# EasyEDA Pro project EEG.eprj

# Schematic Schematic3
Create Date: 2023-07-28; Page Name: MULTI_PROCESS; Project Name: EEG; Schematic Name: Schematic3; Update Date: 2023-07-29; Company: EasyEDA.com; Drawed: EasyEDA Pro; Page Size: A4; Part Number: JLCPCB-002; Reviewed: EasyEDA Pro; Version: V0.1
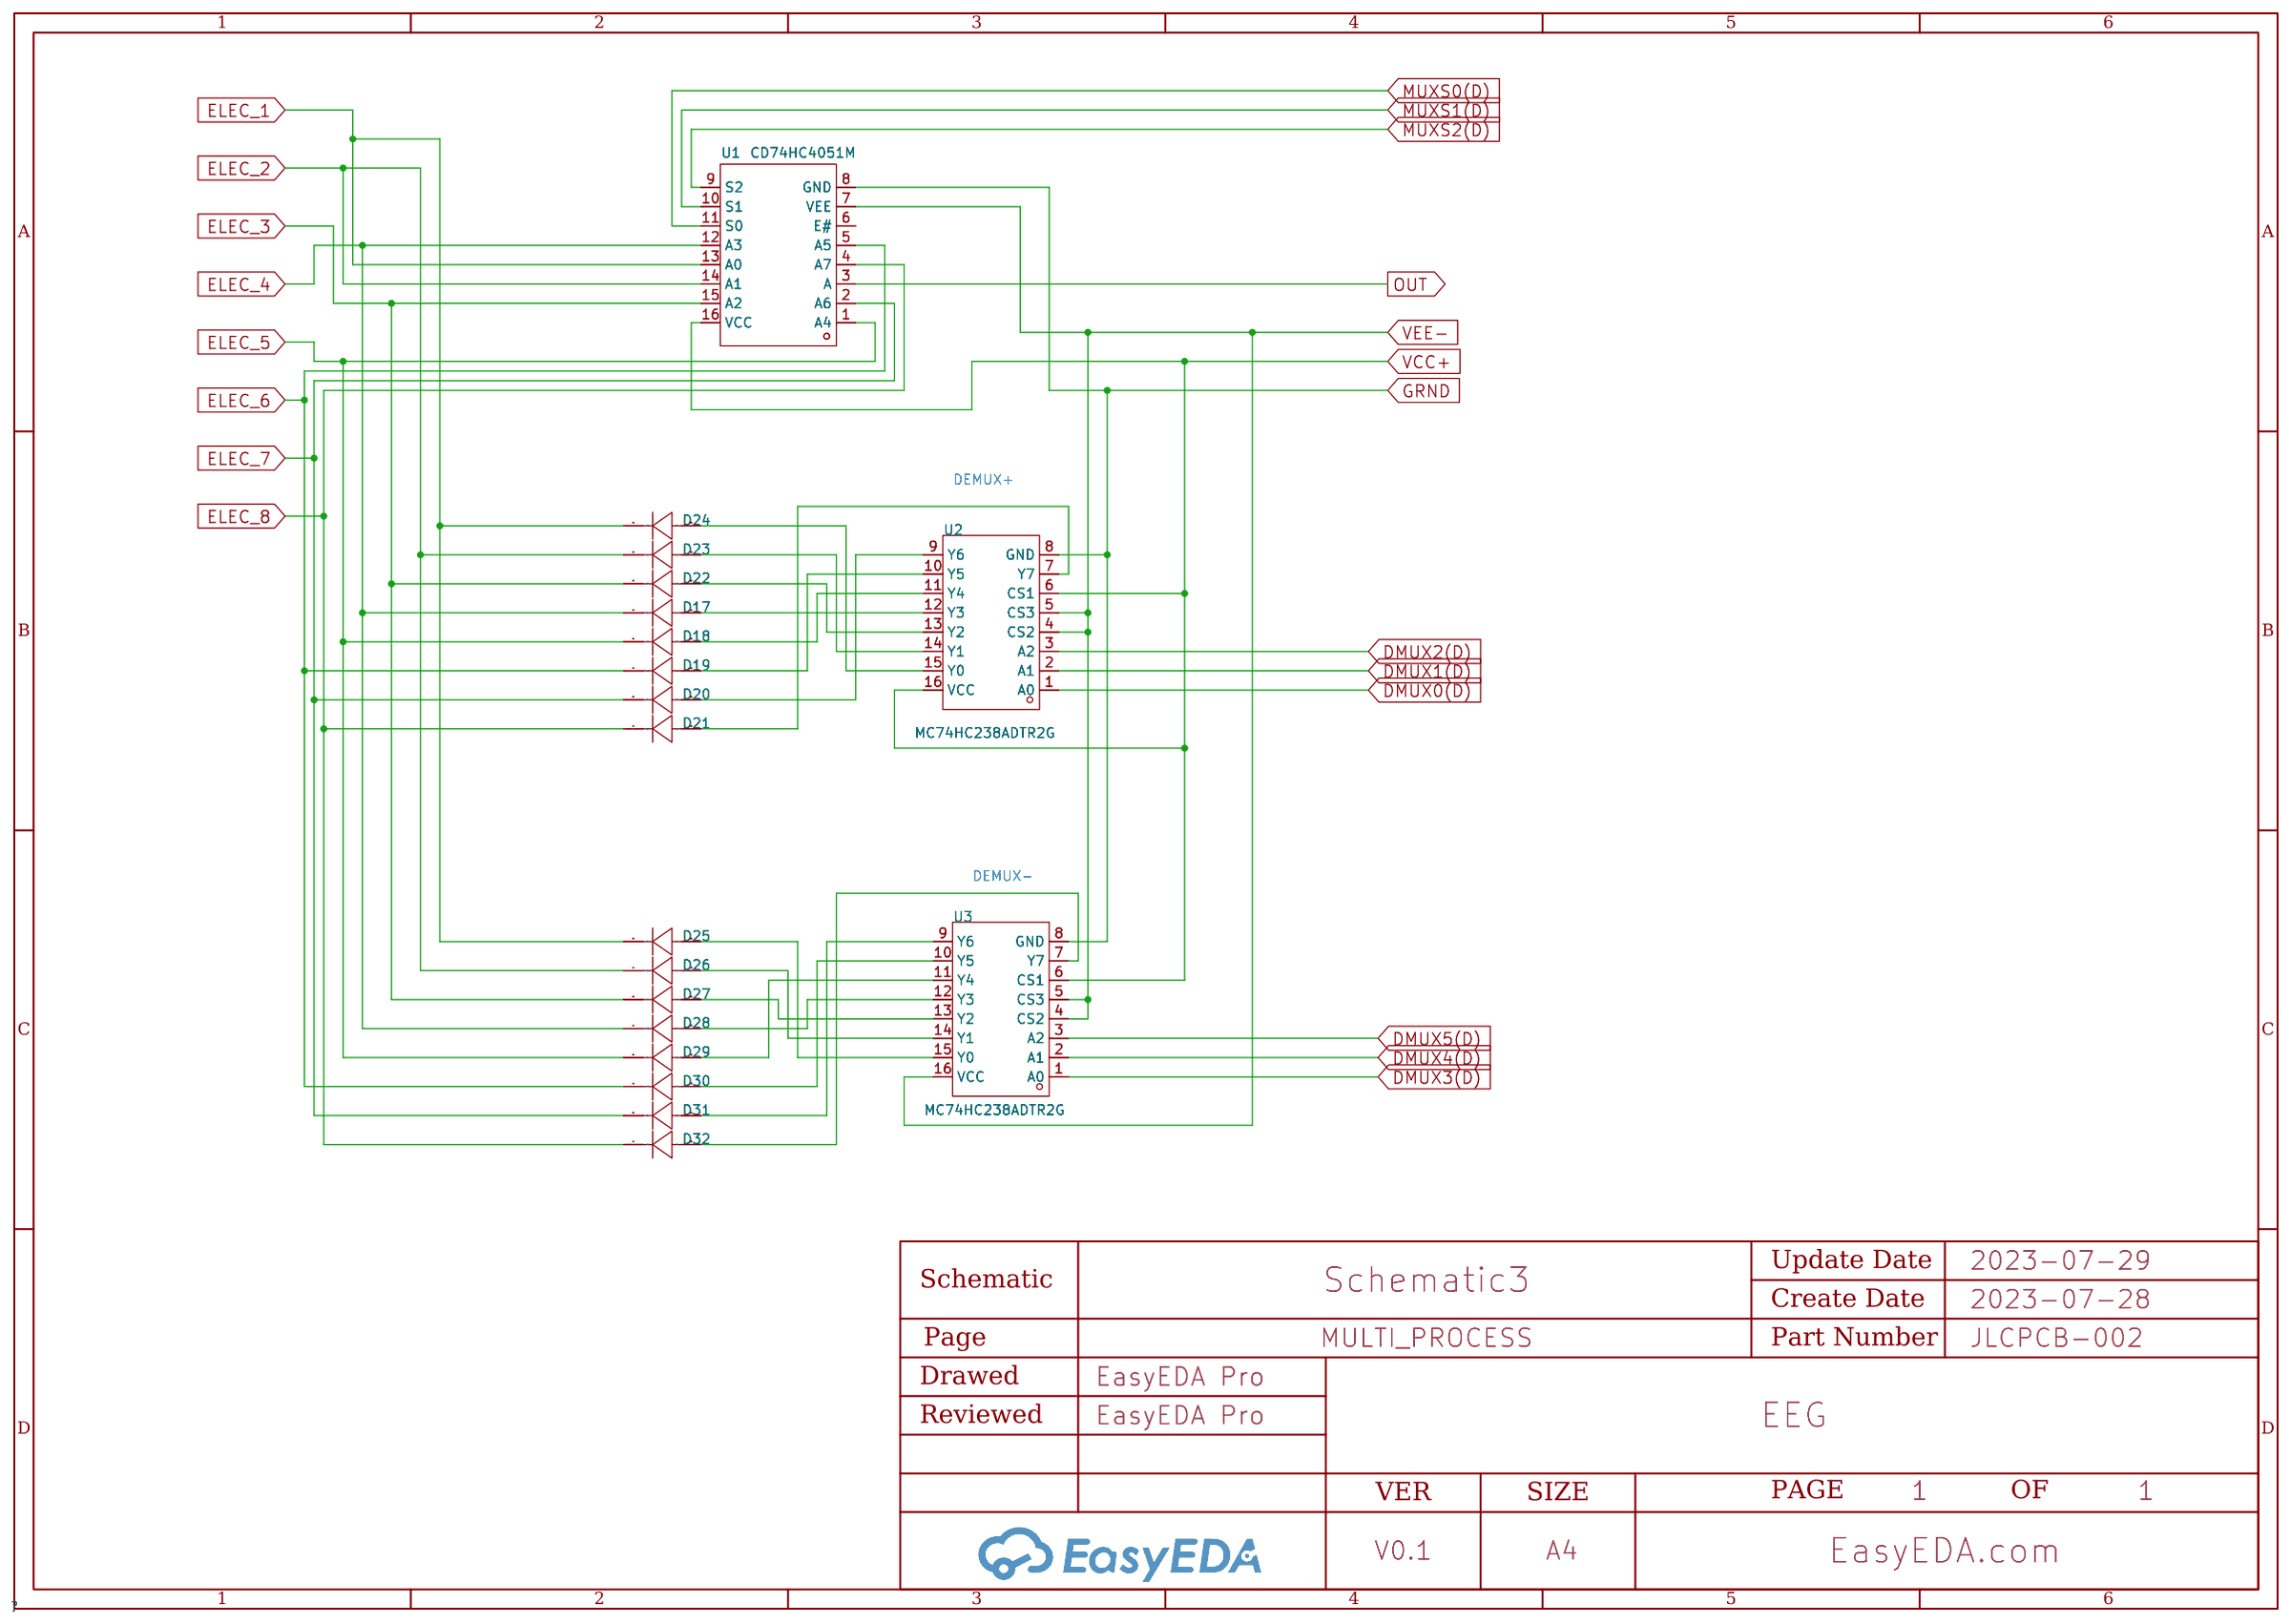
[diagram p0: schematic sheet]

## Parts
D17  -  [DO-41_BD2.4-L4.7-P8.70-D0.9-RD]
D18  -  [DO-41_BD2.4-L4.7-P8.70-D0.9-RD]
D19  -  [DO-41_BD2.4-L4.7-P8.70-D0.9-RD]
D20  -  [DO-41_BD2.4-L4.7-P8.70-D0.9-RD]
D21  -  [DO-41_BD2.4-L4.7-P8.70-D0.9-RD]
D22  -  [DO-41_BD2.4-L4.7-P8.70-D0.9-RD]
D23  -  [DO-41_BD2.4-L4.7-P8.70-D0.9-RD]
D24  -  [DO-41_BD2.4-L4.7-P8.70-D0.9-RD]
D25  -  [DO-41_BD2.4-L4.7-P8.70-D0.9-RD]
D26  -  [DO-41_BD2.4-L4.7-P8.70-D0.9-RD]
D27  -  [DO-41_BD2.4-L4.7-P8.70-D0.9-RD]
D28  -  [DO-41_BD2.4-L4.7-P8.70-D0.9-RD]
D29  -  [DO-41_BD2.4-L4.7-P8.70-D0.9-RD]
D30  -  [DO-41_BD2.4-L4.7-P8.70-D0.9-RD]
D31  -  [DO-41_BD2.4-L4.7-P8.70-D0.9-RD]
D32  -  [DO-41_BD2.4-L4.7-P8.70-D0.9-RD]
U1  CD74HC4051M  [SOIC-16_L9.9-W3.9-P1.27-LS6.0-BL]
U2  MC74HC238ADTR2G  [TSSOP-16_L5.0-W4.3-P0.65-LS6.4-BL]
U3  MC74HC238ADTR2G  [TSSOP-16_L5.0-W4.3-P0.65-LS6.4-BL]

## Library data of the parts
D17-D32 = 1N4007: Supplier Footprint: DO-41
U1 = CD74HC4051M: Switch Circuit:-; Supplier Part: C139301; Manufacturer: TI(德州仪器); Supplier Footprint: SOIC-16; JLCPCB Part Class: Extended Part; Datasheet: https://atta.szlcsc.com/upload/public/pdf/source/20171107/C139301_15100518520421097216.pdf; Supplier: LCSC
U2 U3 = MC74HC238ADTR2G: Type:Decoder/Demultiplexers Sink Current:5.2mA Source Current:5.2mA Voltage Supply Source:Single supply Supply Voltage:2V~6V Supply Voltage:2V~6V Operating temperature:-55℃~+125℃ Operating temperature:-55℃~+125℃; LCSC Part Name: 解码器/多路分解器 2V~6V; Supplier Part: C904037; Manufacturer: onsemi(安森美); Supplier Footprint: TSSOP-16-4.3mm; JLCPCB Part Class: Extended Part; Datasheet: https://atta.szlcsc.com/upload/public/pdf/source/20210719/C904037_FA4C95E1BBB3BF0ECDAA59D4FD74D25B.pdf; Supplier: LCSC; Type: Decoder/Demultiplexers; Sink Current: 5.2mA; Source Current: 5.2mA; Voltage Supply Source: Single supply; Supply Voltage: 2V~6V; Operating temperature: -55℃~+125℃

## Nets
VCC+: U1.16(VCC) U2.6(CS1) U2.16(VCC) U3.6(CS1)
VEE-: U1.7(VEE) U2.4(CS2) U2.5(CS3) U3.4(CS2) U3.5(CS3) U3.16(VCC)
DMUX0(D): U2.1(A0)
DMUX1(D): U2.2(A1)
DMUX2(D): U2.3(A2)
DMUX3(D): U3.1(A0)
DMUX4(D): U3.2(A1)
DMUX5(D): U3.3(A2)
ELEC_1: D24.1(K) D25.1(K) U1.13(A0)
ELEC_2: D23.1(K) D26.1(K) U1.14(A1)
ELEC_3: D22.1(K) D27.1(K) U1.15(A2)
ELEC_4: D17.1(K) D28.1(K) U1.12(A3)
ELEC_5: D18.1(K) D29.1(K) U1.1(A4)
ELEC_6: D19.1(K) D30.1(K) U1.5(A5)
ELEC_7: D20.1(K) D31.1(K) U1.2(A6)
ELEC_8: D21.1(K) D32.1(K) U1.4(A7)
GRND: U1.8(GND) U2.8(GND) U3.8(GND)
MUXS0(D): U1.11(S0)
MUXS1(D): U1.10(S1)
MUXS2(D): U1.9(S2)
OUT: U1.3(A)
$1N1255: D24.2(A) U2.15(Y0)
$1N1260: D23.2(A) U2.14(Y1)
$1N1265: D22.2(A) U2.13(Y2)
$1N1270: D17.2(A) U2.12(Y3)
$1N1273: D18.2(A) U2.11(Y4)
$1N1278: D19.2(A) U2.10(Y5)
$1N1283: D20.2(A) U2.9(Y6)
$1N1288: D21.2(A) U2.7(Y7)
$1N1295: D25.2(A) U3.15(Y0)
$1N1300: D26.2(A) U3.14(Y1)
$1N1305: D27.2(A) U3.13(Y2)
$1N1318: D29.2(A) U3.11(Y4)
$1N1345: D28.2(A) U3.12(Y3)
$1N1348: D30.2(A) U3.10(Y5)
$1N1353: D31.2(A) U3.9(Y6)
$1N1358: D32.2(A) U3.7(Y7)

Not connected (* = marked no-connect by the designer): U1 6(E#)

## Notes on the sheet
- DEMUX+
- DEMUX-

# Schematic Schematic4
Create Date: 2023-07-28; Page Name: P1; Project Name: EEG; Schematic Name: Schematic4; Update Date: 2023-07-29; Company: EasyEDA.com; Drawed: EasyEDA Pro; Page Size: A4; Part Number: JLCPCB-002; Reviewed: EasyEDA Pro; Version: V0.1
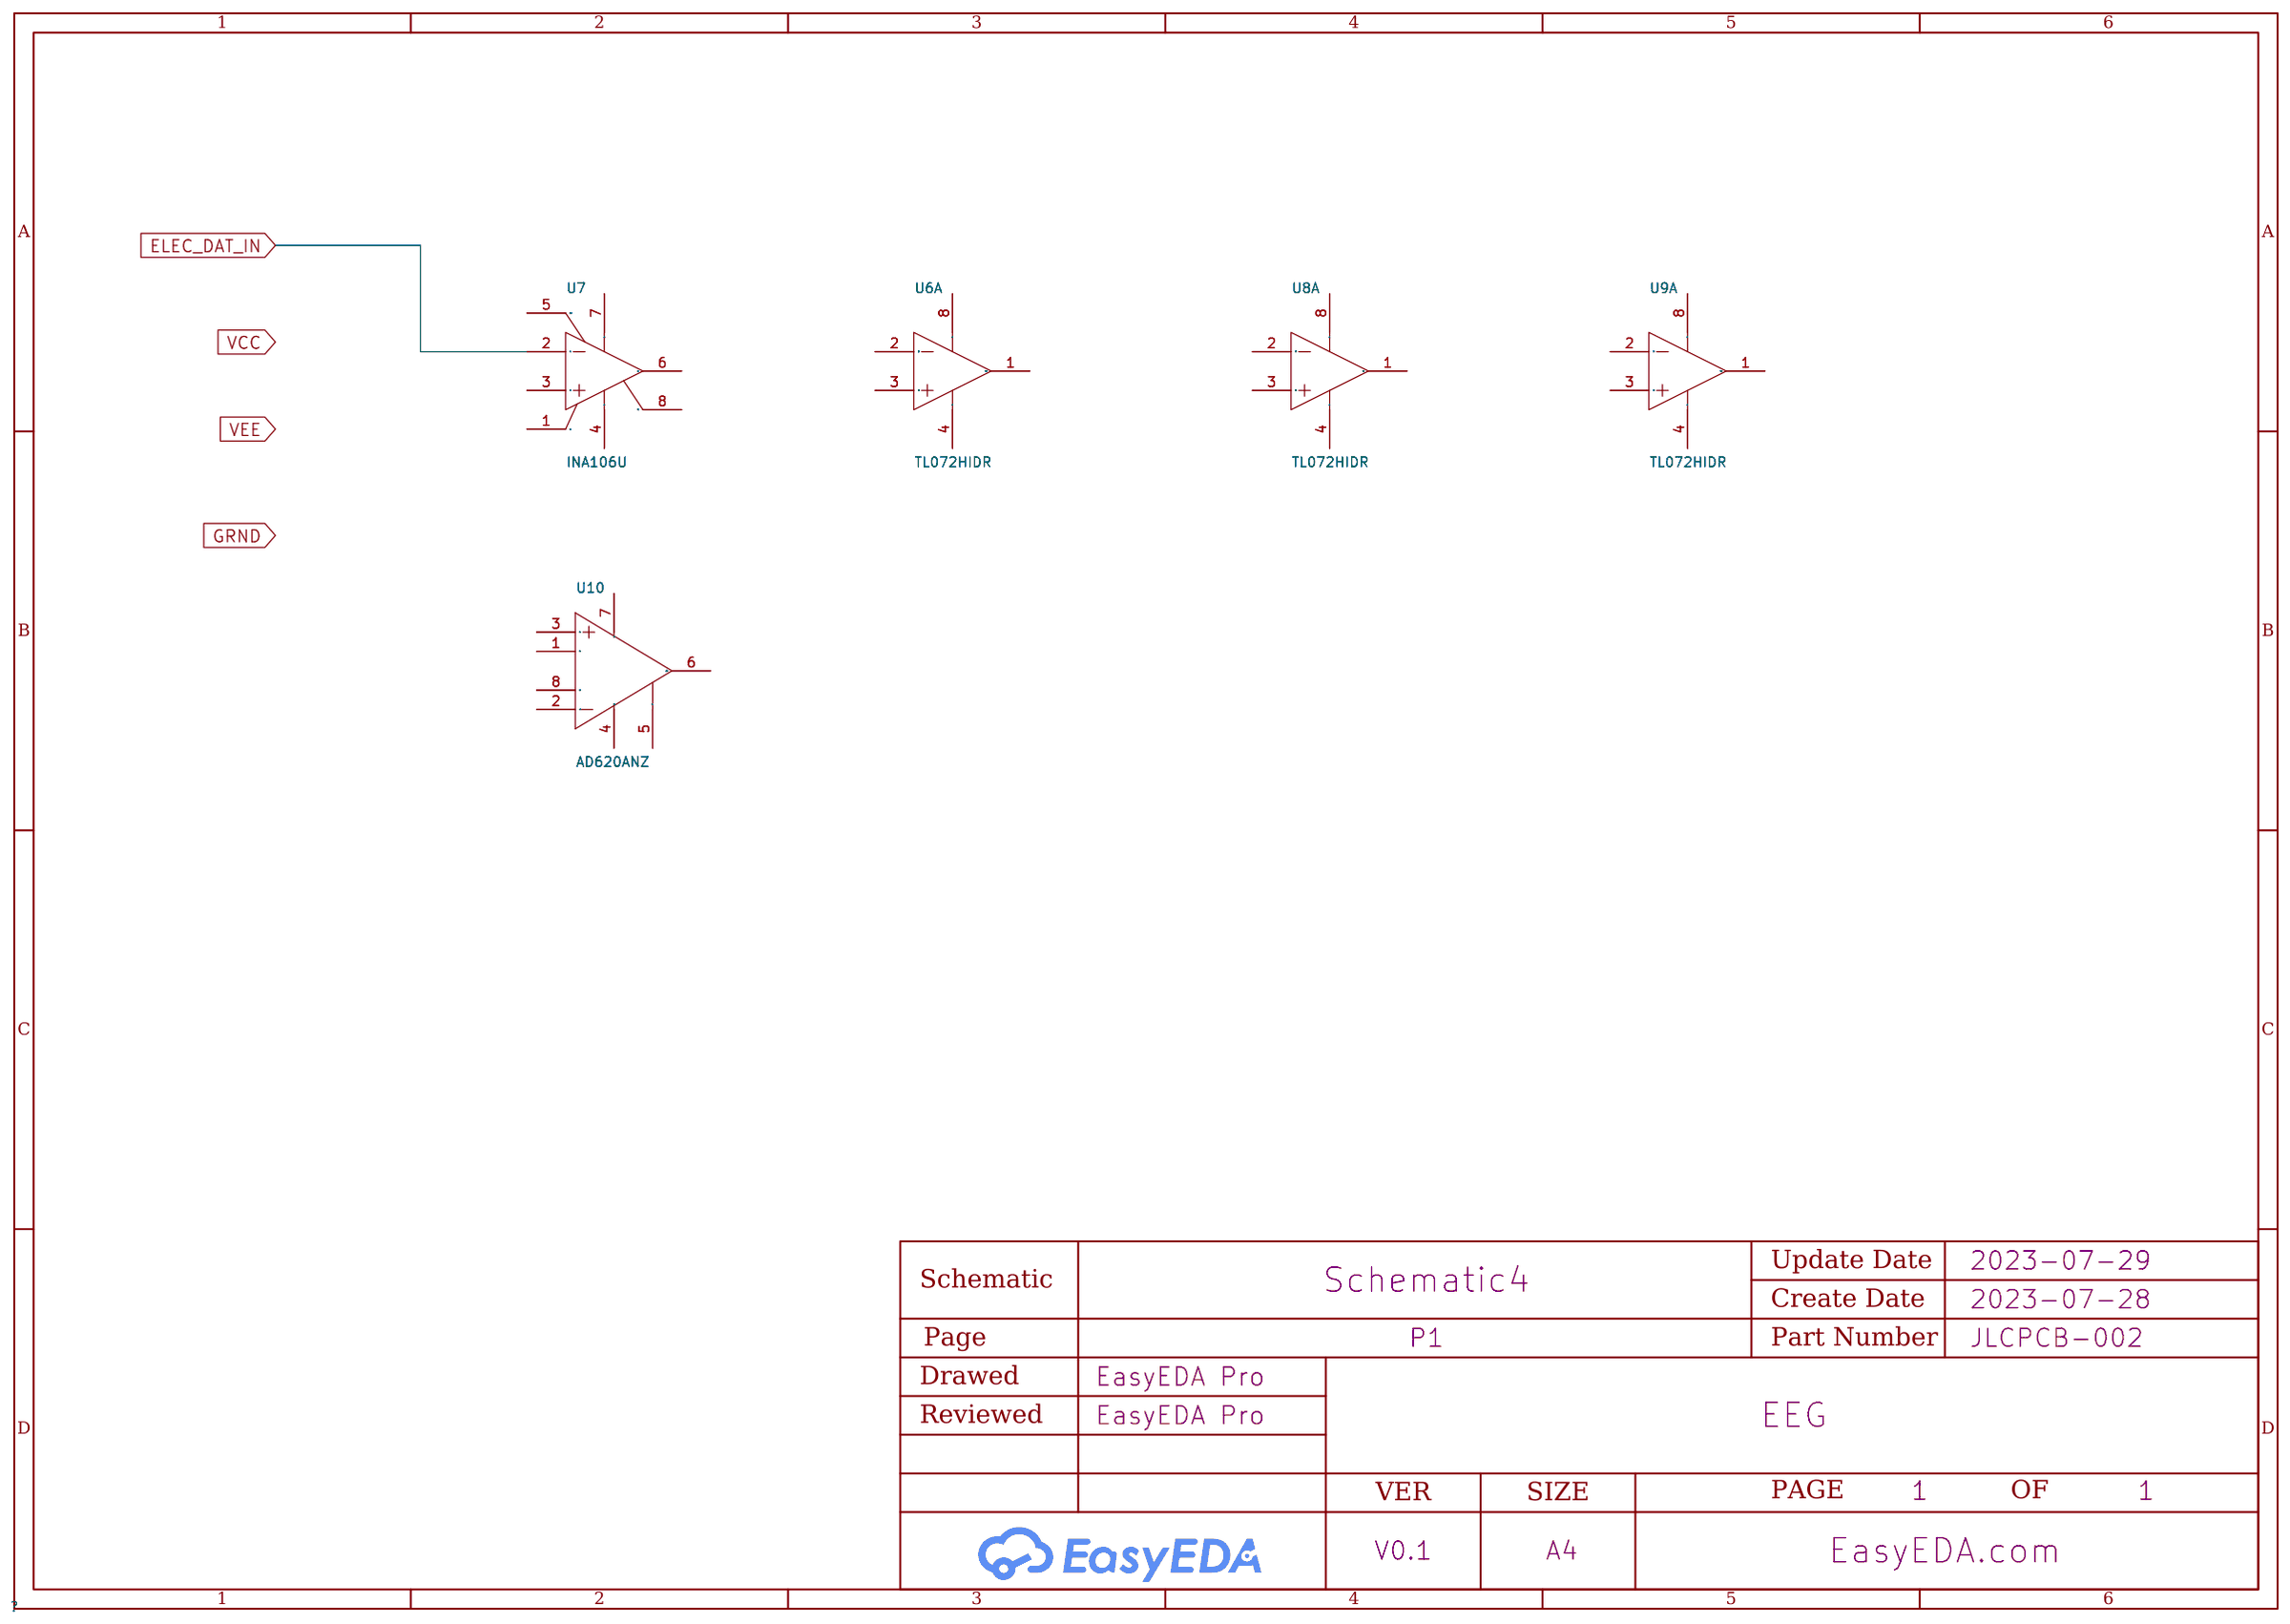
[diagram p1: schematic sheet]

## Parts
U6  TL072HIDR  [SOIC-8_L4.9-W3.9-P1.27-LS6.0-BL]  (section 1)
U7  INA106U  [SOIC-8_L5.0-W4.0-P1.27-LS6.0-BL]
U8  TL072HIDR  [SOIC-8_L4.9-W3.9-P1.27-LS6.0-BL]  (section 1)
U9  TL072HIDR  [SOIC-8_L4.9-W3.9-P1.27-LS6.0-BL]  (section 1)
U10  AD620ANZ  [DIP-8_L9.3-W6.4-P2.54-LS7.6-BL]

## Library data of the parts
U6 U8 U9 = TL072HIDR: Number of Circuits:2 Gain Bandwidth Product(GBP):3MHz Slew Rate(SR):20V/us Current - Input Bias(Ib):1pA Operating Temperature:-40℃~+125℃ Operating Temperature:-40℃~+125℃; Supplier Part: C4370389; Manufacturer: TI(德州仪器); Supplier Footprint: SOIC-8; JLCPCB Part Class: Extended Part; Datasheet: https://atta.szlcsc.com/upload/public/pdf/source/20230221/CF9AD0C7A1EBE0D7819F493A0663F625.pdf; Supplier: LCSC; Number of Circuits: 2; Gain Bandwidth Product(GBP): 3MHz; Slew Rate(SR): 20V/us; Current - Input Bias(Ib): 1pA; Operating Temperature: -40℃~+125℃
U7 = INA106U: Supplier Part: C1347713; Manufacturer: TI(德州仪器); Supplier Footprint: SOIC-8; JLCPCB Part Class: Extended Part; Datasheet: https://atta.szlcsc.com/upload/public/pdf/source/20230221/493F104B2959D266D535B06BA4E4D337.pdf; Supplier: LCSC
U10 = AD620ANZ: Amplifier Type: Number of Circuits: Gain Bandwidth Product（GBP）: Slew Rate（SR）: Output Type: Supply Voltage（Single）: Iq per channel (Typ): Operating Temperature:; Supplier Part: C9680; Manufacturer: ADI(亚德诺)/LINEAR(凌特); Supplier Footprint: DIP-8; JLCPCB Part Class: Extended Part; Datasheet: https://atta.szlcsc.com/upload/public/pdf/source/20121103/1457706545320.pdf; Supplier: LCSC

## Nets
ELEC_DAT_IN: U7.2(IN-)

Not connected (* = marked no-connect by the designer): U6 1(OUT1) 2(IN1-) 3(IN1+) 4(V-) 8(V+); U7 1(REF) 3(IN+) 4(V-) 5(Sense) 6(OUT) 7(V+) 8(NC); U8 1(OUT1) 2(IN1-) 3(IN1+) 4(V-) 8(V+); U9 1(OUT1) 2(IN1-) 3(IN1+) 4(V-) 8(V+); U10 1(RG) 2(-IN) 3(+IN) 4(-VS) 5(REF) 6(OUTPUT) 7(+VS) 8(RG)

# Board MULTI_PROCESS
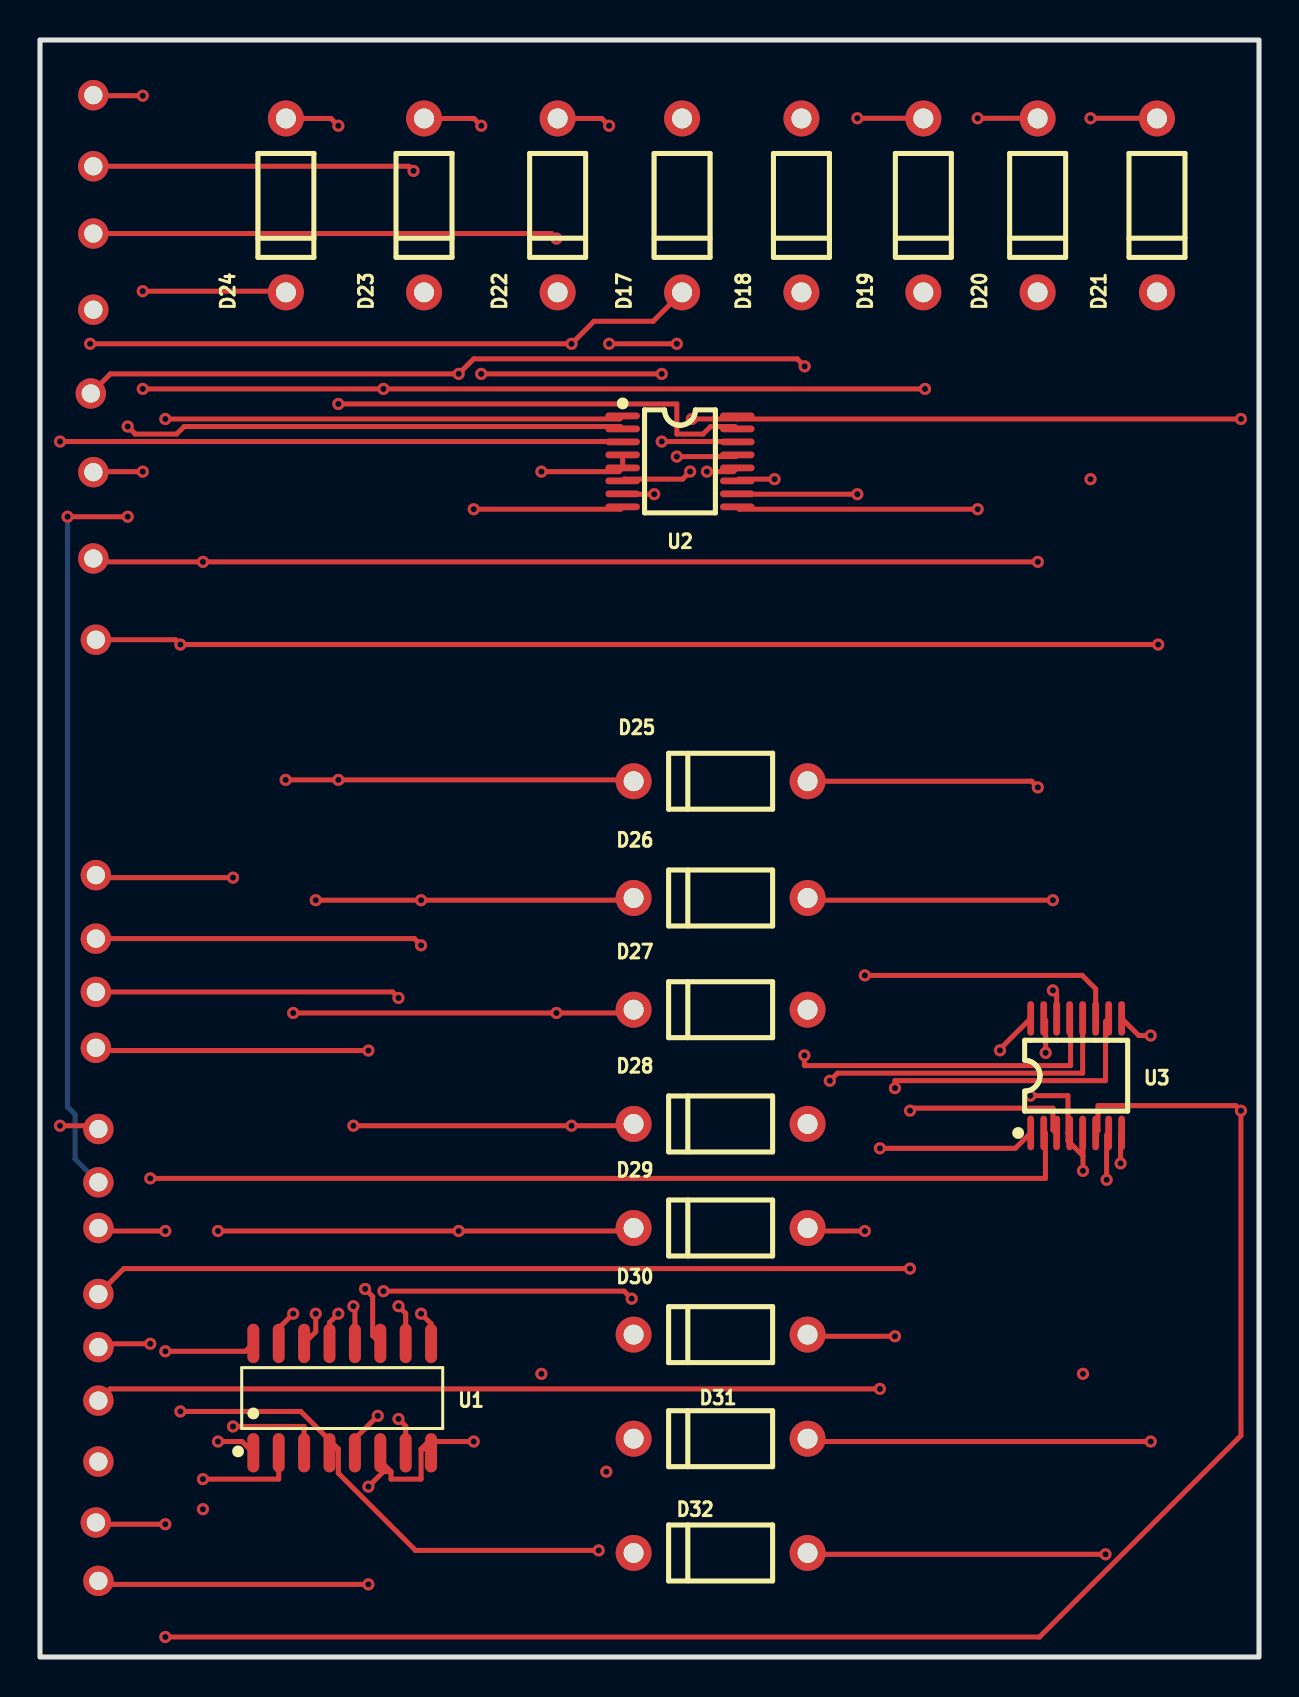
[diagram p2: board, top side]
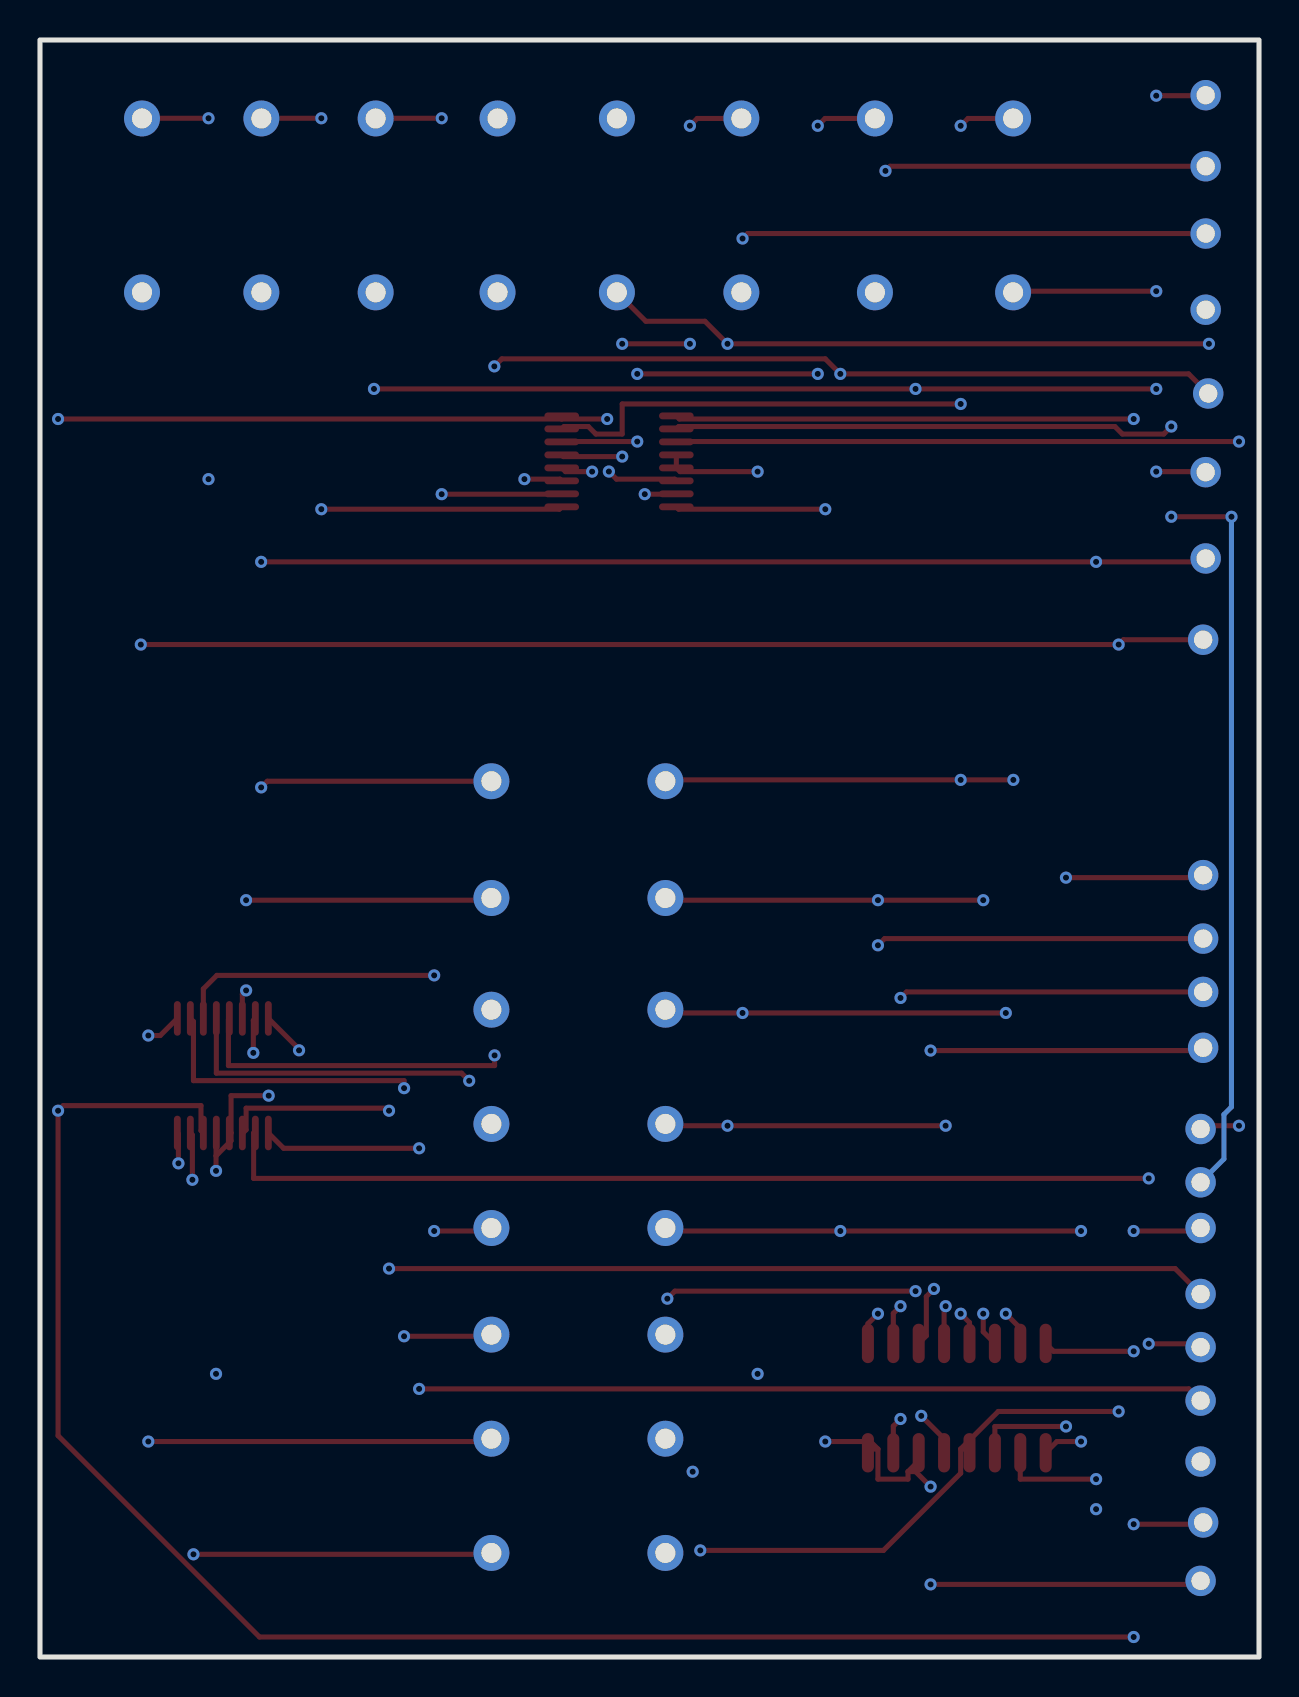
[diagram p3: board, bottom side, seen from below]

Outline 60.96 x 80.9 mm; copper layers: Top Layer, Inner1, Inner2, Bottom Layer. Coordinates in mm from the lower left corner of the outline.
Outline path: rectangle 0,80.9 60.96,0
Stack: Top Layer 0.035mm / Dielectric1 0.48mm PP er 4.5 / Inner1 0.035mm / Dielectric2 0.48mm FR4 er 4.5 / Inner2 0.035mm / Dielectric3 0.48mm PP er 4.5 / Bottom Layer 0.035mm

## Design rules (mm)
template: JLCPCB Capability(Two Layers Board)
spacing copperThickness1oz (default): track to track 0.102, other pairs 0.152 to 0.3
spacing copperThickness2oz: track to track 0.203, other pairs 0.152 to 0.3
track width copperThickness1oz (default): min 0.127, default 0.254, max 2.54
track width copperThickness2oz: min 0.203, default 0.254, max 2.54
differential pair differentialPair (default): width min 0.127, default 0.254, max 2.54; gap min 0.152, default 0.152
via viaSize (default): diameter min 0.5, default 0.61, max 10; hole min 0.3, default 0.305, max 6.3

## Placement (name value [footprint] x y rotation side)
D17  -  [DO-41_BD2.4-L4.7-P8.70-D0.9-RD]  32.11 72.62 90 top
D18  -  [DO-41_BD2.4-L4.7-P8.70-D0.9-RD]  38.08 72.62 90 top
D19  -  [DO-41_BD2.4-L4.7-P8.70-D0.9-RD]  44.17 72.62 90 top
D20  -  [DO-41_BD2.4-L4.7-P8.70-D0.9-RD]  49.89 72.62 90 top
D21  -  [DO-41_BD2.4-L4.7-P8.70-D0.9-RD]  55.86 72.62 90 top
D22  -  [DO-41_BD2.4-L4.7-P8.70-D0.9-RD]  25.89 72.62 90 top
D23  -  [DO-41_BD2.4-L4.7-P8.70-D0.9-RD]  19.21 72.62 90 top
D24  -  [DO-41_BD2.4-L4.7-P8.70-D0.9-RD]  12.3 72.62 90 top
D25  -  [DO-41_BD2.4-L4.7-P8.70-D0.9-RD]  34.04 43.81 0 top
D26  -  [DO-41_BD2.4-L4.7-P8.70-D0.9-RD]  34.04 37.97 0 top
D27  -  [DO-41_BD2.4-L4.7-P8.70-D0.9-RD]  34.04 32.38 0 top
D28  -  [DO-41_BD2.4-L4.7-P8.70-D0.9-RD]  34.04 26.67 0 top
D29  -  [DO-41_BD2.4-L4.7-P8.70-D0.9-RD]  34.04 21.46 0 top
D30  -  [DO-41_BD2.4-L4.7-P8.70-D0.9-RD]  34.04 16.13 0 top
D31  -  [DO-41_BD2.4-L4.7-P8.70-D0.9-RD]  34.04 10.92 0 top
D32  -  [DO-41_BD2.4-L4.7-P8.70-D0.9-RD]  34.04 5.21 0 top
NOREF  -  [Pad_e112]  2.79 39.12 0 top
NOREF#2  -  [Pad_e104]  2.67 74.58 0 top
NOREF#3  -  [Pad_e106]  2.67 71.21 0 top
NOREF#4  -  [Pad_e115]  2.79 30.48 0 top
NOREF#5  -  [Pad_e107]  2.67 67.4 0 top
NOREF#6  -  [Pad_e129]  2.92 9.78 0 top
NOREF#7  -  [Pad_e128]  2.79 6.73 0 top
NOREF#8  -  [Pad_e118]  2.92 21.46 0 top
NOREF#9  -  [Pad_e111]  2.79 50.89 0 top
NOREF#10  -  [Pad_e108]  2.54 63.21 0 top
NOREF#11  -  [Pad_e109]  2.67 59.28 0 top
NOREF#12  -  [Pad_e121]  2.92 23.75 0 top
NOREF#13  -  [Pad_e124]  2.92 15.5 0 top
NOREF#14  -  [Pad_e102]  2.67 78.14 0 top
NOREF#15  -  [Pad_e110]  2.67 54.96 0 top
NOREF#16  -  [Pad_e130]  2.92 3.81 0 top
NOREF#17  -  [Pad_e125]  2.92 18.16 0 top
NOREF#18  -  [Pad_e122]  2.92 26.42 0 top
NOREF#19  -  [Pad_e117]  2.79 35.94 0 top
NOREF#20  -  [Pad_e116]  2.79 33.27 0 top
NOREF#21  -  [Pad_e123]  2.92 12.83 0 top
U1  CD74HC4051M  [SOIC-16_L9.9-W3.9-P1.27-LS6.0-BL]  15.11 12.95 0 top
U2  MC74HC238ADTR2G  [TSSOP-16_L5.0-W4.3-P0.65-LS6.4-BL]  32 59.82 270 top
U3  MC74HC238ADTR2G  [TSSOP-16_L5.0-W4.3-P0.65-LS6.4-BL]  51.82 29.08 0 top

## Footprints (pads in the part's own frame, mm; a bottom-side part is the same pattern mirrored in y, then rotated)
DO-41_BD2.4-L4.7-P8.70-D0.9-RD
  round 1.8 hole 1: 1(-4.35,0) 2(4.35,0)
Pad_e102
  round 1.524 hole 0.914: E1(0,0)
Pad_e104
  round 1.524 hole 0.914: E2(0,0)
Pad_e106
  round 1.524 hole 0.914: E3(0,0)
Pad_e107
  round 1.524 hole 0.914: E4(0,0)
Pad_e108
  round 1.524 hole 0.914: E5(0,0)
Pad_e109
  round 1.524 hole 0.914: E6(0,0)
Pad_e110
  round 1.524 hole 0.914: E7(0,0)
Pad_e111
  round 1.524 hole 0.914: E8(0,0)
Pad_e112
  round 1.524 hole 0.914: OUT(0,0)
Pad_e115
  round 1.524 hole 0.914: MUX0(0,0)
Pad_e116
  round 1.524 hole 0.914: MUX1(0,0)
Pad_e117
  round 1.524 hole 0.914: MUX2(0,0)
Pad_e118
  round 1.524 hole 0.914: DMUX0(0,0)
Pad_e121
  round 1.524 hole 0.914: DMUX1(0,0)
Pad_e122
  round 1.524 hole 0.914: DMUX2(0,0)
Pad_e123
  round 1.524 hole 0.914: DMUX3(0,0)
Pad_e124
  round 1.524 hole 0.914: DMUX4(0,0)
Pad_e125
  round 1.524 hole 0.914: DMUX5(0,0)
Pad_e128
  round 1.524 hole 0.914: VCC(0,0)
Pad_e129
  round 1.524 hole 0.914: VEE(0,0)
Pad_e130
  round 1.524 hole 0.914: GRND(0,0)
SOIC-16_L9.9-W3.9-P1.27-LS6.0-BL
  oval 0.602x1.971 smd: 1(-4.445,-2.736) 2(-3.175,-2.736) 3(-1.905,-2.736) 4(-0.635,-2.736) 5(0.635,-2.736) 6(1.905,-2.736) 7(3.175,-2.736) 8(4.445,-2.736) 9(4.445,2.736) 10(3.175,2.736) 11(1.905,2.736) 12(0.635,2.736) 13(-0.635,2.736) 14(-1.905,2.736) 15(-3.175,2.736) 16(-4.445,2.736)
TSSOP-16_L5.0-W4.3-P0.65-LS6.4-BL
  oval 0.343x1.732 smd: 1(-2.275,-2.866) 2(-1.625,-2.866) 3(-0.975,-2.866) 4(-0.325,-2.866) 5(0.325,-2.866) 6(0.975,-2.866) 7(1.625,-2.866) 8(2.275,-2.866) 9(2.275,2.866) 10(1.625,2.866) 11(0.975,2.866) 12(0.325,2.866) 13(-0.325,2.866) 14(-0.975,2.866) 15(-1.625,2.866) 16(-2.275,2.866)

## Nets
VCC+: NOREF#7.VCC U1.16 U2.6 U2.16 U3.6
VEE-: NOREF#6.VEE U1.7 U2.4 U2.5 U3.4 U3.5 U3.16
DMUX0(D): NOREF#8.DMUX0 U2.1
DMUX1(D): NOREF#12.DMUX1 U2.2
DMUX2(D): NOREF#18.DMUX2 U2.3
DMUX3(D): NOREF#21.DMUX3 U3.1
DMUX4(D): NOREF#13.DMUX4 U3.2
DMUX5(D): NOREF#17.DMUX5 U3.3
ELEC_1: D24.1 D25.1 NOREF#14.E1 U1.13
ELEC_2: D23.1 D26.1 NOREF#2.E2 U1.14
ELEC_3: D22.1 D27.1 NOREF#3.E3 U1.15
ELEC_4: D17.1 D28.1 NOREF#5.E4 U1.12
ELEC_5: D18.1 D29.1 NOREF#10.E5 U1.1
ELEC_6: D19.1 D30.1 NOREF#11.E6 U1.5
ELEC_7: D20.1 D31.1 NOREF#15.E7 U1.2
ELEC_8: D21.1 D32.1 NOREF#9.E8 U1.4
GRND: NOREF#16.GRND U1.6 U1.8 U2.8 U3.8
MUXS0(D): NOREF#4.MUX0 U1.11
MUXS1(D): NOREF#20.MUX1 U1.10
MUXS2(D): NOREF#19.MUX2 U1.9
OUT: NOREF.OUT U1.3
$1N1255: D24.2 U2.15
$1N1260: D23.2 U2.14
$1N1265: D22.2 U2.13
$1N1270: D17.2 U2.12
$1N1273: D18.2 U2.11
$1N1278: D19.2 U2.10
$1N1283: D20.2 U2.9
$1N1288: D21.2 U2.7
$1N1295: D25.2 U3.15
$1N1300: D26.2 U3.14
$1N1305: D27.2 U3.13
$1N1318: D29.2 U3.11
$1N1345: D28.2 U3.12
$1N1348: D30.2 U3.10
$1N1353: D31.2 U3.9
$1N1358: D32.2 U3.7

## Via types
v1: diameter 0.61, hole 0.305, Top Layer to Bottom Layer, 112 vias

## Routing (per net, layer and track width the routed paths; a pad name or vN(x,y) marks a point on that pad's centre or on a via; arc(x,y) is an arc through that point)
VCC+: length 173.7
  Top Layer w0.254: U2.6 29.22,58.93 32.13,58.93 v1(32.51,59.31) ; 34.87,61.94 v1(60.06,61.94) ; 34.87,61.94 34.87,62.09 ; 34.87,61.94 v1(32.6,61.94) ; v1(6.27,1) 49.98,1 60.06,11.07 v1(60.06,27.33) 59.8,27.59 52.91,27.59 52.91,26.34 U3.6 ; v1(6.27,6.64) 2.88,6.64 NOREF#7.VCC ; v1(6.27,15.29) 10.27,15.29 U1.16
  Inner1 w0.254: v1(6.27,1) v1(6.27,6.64) v1(6.27,15.29) ; v1(32.6,61.94) 32.51,61.85 v1(32.51,59.31) ; v1(60.06,61.94) v1(60.06,27.33)
VEE-: length 126.5
  Top Layer w0.254: 51.41,26.22 51.41,25.83 52.16,25.07 ; 51.41,26.22 51.41,28.08 v1(49.52,28.08) ; 51.41,26.22 U3.4 ; 52.16,25.07 v1(52.16,24.32) ; 52.16,25.07 52.16,26.2 U3.5 ; U1.7 18.29,11.55 v1(17.93,11.91) ; v1(25.07,59.3) 28.95,59.3 U2.5 U2.4 ; v1(48.01,30.35) 48.01,30.41 U3.16
  Inner1 w0.254: v1(52.16,24.32) v1(52.16,14.17) ; v1(49.52,28.08) 48.01,29.6 v1(48.01,30.35) ; v1(25.07,59.3) v1(25.07,14.17)
  Inner2 w0.254: 25.07,13.41 24.32,12.66 17.93,12.66 17.93,11.83 15.88,9.78 NOREF#6.VEE ; 25.07,13.41 v1(25.07,14.17) ; 25.07,13.41 25.83,14.17 v1(52.16,14.17)
DMUX0(D): length 67
  Top Layer w0.254: NOREF#8.DMUX0 3.07,21.31 v1(6.27,21.31) ; v1(6.27,61.94) 28.98,61.94 U2.1
  Inner1 w0.254: v1(6.27,61.94) v1(6.27,21.31)
DMUX1(D): length 66.6
  Top Layer w0.254: U2.2 29.02,61.56 7.21,61.56 6.83,61.18 4.76,61.18 v1(4.39,61.56) ; v1(4.39,57.05) v1(1.38,57.05)
  Inner1 w0.254: v1(4.39,61.56) v1(4.39,57.05)
  Bottom Layer w0.254: v1(1.38,57.05) 1.38,27.52 1.75,27.14 1.75,24.92 NOREF#12.DMUX1
DMUX2(D): length 64.7
  Top Layer w0.254: v1(1,60.81) 29.12,60.81 U2.3 ; NOREF#18.DMUX2 2.76,26.58 v1(1,26.58)
  Inner1 w0.254: v1(1,60.81) 0.63,60.43 0.63,26.96 v1(1,26.58)
DMUX3(D): length 59.2
  Top Layer w0.254: v1(42,13.41) 3.51,13.41 NOREF#21.DMUX3 ; v1(42,25.45) 48.77,25.45 U3.1
  Inner1 w0.254: v1(42,25.45) v1(42,13.41)
DMUX4(D): length 58.1
  Top Layer w0.254: v1(5.52,15.67) 3.09,15.67 NOREF#13.DMUX4 ; U3.2 50.28,26.22 50.28,23.95 v1(5.52,23.95)
  Inner1 w0.254: v1(5.52,23.95) v1(5.52,15.67)
DMUX5(D): length 57.6
  Top Layer w0.254: U3.3 50.83,26.2 50.65,26.38 50.65,27.46 43.63,27.46 v1(43.51,27.33) ; NOREF#17.DMUX5 4.19,19.43 v1(43.51,19.43)
  Inner1 w0.254: v1(43.51,27.33) v1(43.51,19.43)
ELEC_1: length 89.6
  Top Layer w0.254: 29.69,43.81 29.62,43.88 v1(14.92,43.88) v1(12.29,43.88) ; v1(5.14,68.33) 12.24,68.33 D24.1 ; v1(5.14,78.11) 2.69,78.11 NOREF#14.E1 ; v1(14.92,17.18) 14.48,16.73 14.48,15.69
  Inner1 w0.254: v1(5.14,68.33) v1(5.14,78.11) ; v1(14.92,17.18) v1(14.92,43.88) ; v1(12.29,43.88) 12.29,68.26 D24.1
ELEC_2: length 91.3
  Top Layer w0.254: U1.14 13.79,16.27 v1(13.79,17.18) ; v1(18.68,74.35) 18.45,74.58 NOREF#2.E2 ; v1(13.79,37.86) v1(19.06,37.86) 29.58,37.86 29.69,37.97
  Inner1 w0.254: v1(13.79,17.18) v1(13.79,37.86) ; v1(18.68,74.35) 19.06,73.97 19.06,68.27 ; D23.1 19.06,68.27 ; 19.06,68.27 v1(19.06,37.86)
ELEC_3: length 96
  Top Layer w0.254: NOREF#3.E3 25.58,71.21 v1(25.83,70.96) ; v1(12.66,17.18) 11.94,16.45 U1.15 ; 29.69,32.38 29.52,32.22 v1(25.83,32.22) v1(12.66,32.22)
  Inner1 w0.254: 25.83,68.27 v1(25.83,70.96) ; 25.83,68.27 v1(25.83,32.22) ; 25.83,68.27 D22.1 ; v1(12.66,17.18) v1(12.66,32.22)
ELEC_4: length 96.5
  Top Layer w0.254: D17.1 30.66,66.83 27.71,66.83 v1(26.58,65.7) v1(2.51,65.7) ; v1(15.67,26.58) v1(26.58,26.58) 29.6,26.58 29.69,26.67 ; U1.12 15.75,17.47 v1(15.67,17.55)
  Inner1 w0.254: NOREF#5.E4 2.51,67.24 v1(2.51,65.7) ; v1(15.67,17.55) v1(15.67,26.58) ; v1(26.58,26.58) v1(26.58,65.7)
ELEC_5: length 116.6
  Top Layer w0.254: v1(8.9,10.78) 10.11,10.78 U1.1 ; NOREF#10.E5 3.52,64.19 v1(20.94,64.19) 21.69,64.95 37.86,64.95 v1(38.24,64.57) ; v1(8.9,21.31) v1(20.94,21.31) 29.54,21.31 29.69,21.46
  Inner1 w0.254: D18.1 38.24,68.11 v1(38.24,64.57) ; v1(20.94,21.31) v1(20.94,64.19) ; v1(8.9,10.78) v1(8.9,21.31)
ELEC_6: length 118.8
  Top Layer w0.254: U1.5 15.75,10.92 v1(16.89,12.06) ; v1(29.59,17.93) 29.21,18.3 v1(17.18,18.3) ; v1(5.14,59.3) 2.69,59.3 NOREF#11.E6 ; v1(44.26,63.44) v1(17.18,63.44) v1(5.14,63.44)
  Inner1 w0.254: D19.1 44.26,68.19 v1(44.26,63.44) ; 29.69,16.13 29.59,16.23 v1(29.59,17.93) ; v1(5.14,63.44) v1(5.14,59.3) ; v1(17.18,63.44) v1(17.18,18.3) 16.89,18.02 v1(16.89,12.06)
ELEC_7: length 137.5
  Top Layer w0.254: v1(49.9,54.79) v1(8.15,54.79) 2.84,54.79 NOREF#15.E7 ; v1(8.15,8.9) 11.94,8.9 U1.2
  Inner1 w0.254: v1(28.32,9.27) 28.32,9.56 29.69,10.92 ; D20.1 49.9,68.26 v1(49.9,54.79) ; v1(8.15,7.4) v1(8.15,8.9) v1(8.15,54.79)
  Inner2 w0.254: v1(8.15,7.4) 28.21,7.4 28.21,9.16 v1(28.32,9.27)
ELEC_8: length 136.1
  Top Layer w0.254: v1(7.02,12.29) 13.04,12.29 14.92,10.41 ; 14.92,10.41 14.92,9.19 18.78,5.33 v1(27.94,5.33) ; 14.92,10.41 14.66,10.41 14.48,10.22 ; v1(55.92,50.65) v1(7.02,50.65) 6.78,50.89 NOREF#9.E8
  Inner1 w0.254: 29.69,5.21 29.56,5.33 v1(27.94,5.33) ; v1(55.92,50.65) 55.92,68.21 D21.1 ; v1(7.02,12.29) v1(7.02,50.65)
GRND: length 141.3
  Top Layer w0.254: v1(16.42,3.63) 3.1,3.63 NOREF#16.GRND ; U1.8 19.37,10.41 19.06,10.41 ; 19.06,10.41 19.06,8.9 17.55,8.9 17.55,9.28 ; 19.06,10.41 19.43,10.78 v1(21.69,10.78) ; v1(54.04,24.7) 54.04,26.16 U3.8 ; 17.55,9.28 17.02,9.81 U1.6 ; 17.55,9.28 17.18,9.28 v1(16.42,8.52) ; v1(21.69,57.42) 29.02,57.42 U2.8
  Inner1 w0.254: v1(21.69,57.42) v1(21.69,10.78) ; v1(54.04,24.7) 54.04,5.06 52.62,3.63 v1(16.42,3.63) v1(16.42,8.52)
MUXS0(D): length 28.7
  Top Layer w0.254: v1(16.42,30.34) 2.93,30.34 NOREF#4.MUX0 ; v1(16.26,18.41) 16.64,18.03 16.64,16.07 U1.11
  Inner1 w0.254: v1(16.26,18.41) 16.26,30.17 v1(16.42,30.34)
MUXS1(D): length 32.7
  Top Layer w0.254: U1.10 18.29,17.19 v1(17.93,17.55) ; NOREF#20.MUX1 17.63,33.27 v1(17.93,32.97)
  Inner1 w0.254: v1(17.93,17.55) v1(17.93,32.97)
MUXS2(D): length 36.5
  Top Layer w0.254: NOREF#19.MUX2 18.72,35.94 v1(19.06,35.61) ; v1(19.06,17.18) 19.56,16.67 U1.9
  Inner1 w0.254: v1(19.06,17.18) v1(19.06,35.61)
OUT: length 39.2
  Top Layer w0.254: U1.3 13.21,11.53 v1(9.65,11.53) ; NOREF.OUT 2.92,38.99 v1(9.65,38.99)
  Inner1 w0.254: v1(9.65,11.53) v1(9.65,38.99)
$1N1255: length 38.4
  Top Layer w0.254: v1(14.92,62.69) 31.85,62.69 31.85,61.18 33.16,61.18 33.54,61.56 34.75,61.56 34.87,61.44 ; v1(14.92,76.61) 14.55,76.97 D24.2
  Inner1 w0.254: v1(14.92,62.69) v1(14.92,76.61)
$1N1260: length 31.6
  Top Layer w0.254: v1(31.09,60.81) 34.85,60.81 34.87,60.79 ; D23.2 21.7,76.97 v1(22.07,76.61) ; v1(31.09,64.19) v1(22.07,64.19)
  Inner1 w0.254: v1(22.07,64.19) v1(22.07,76.61) ; v1(31.09,60.81) v1(31.09,64.19)
$1N1265: length 25.7
  Top Layer w0.254: 34.87,60.14 34.78,60.06 v1(31.85,60.06) ; v1(28.46,76.61) 28.09,76.97 D22.2 ; v1(31.85,65.7) v1(28.46,65.7)
  Inner1 w0.254: v1(28.46,65.7) v1(28.46,76.61) ; v1(31.85,60.06) v1(31.85,65.7)
$1N1270: length 19.8
  Top Layer w0.254: 34.87,59.49 34.68,59.3 v1(33.35,59.3)
  Inner1 w0.254: v1(33.35,59.3) 33.35,75.73 D17.2
$1N1273: length 20.5
  Top Layer w0.254: v1(36.73,58.93) 34.96,58.93 34.87,58.84
  Inner1 w0.254: v1(36.73,58.93) 36.73,75.63 D18.2
$1N1278: length 28.1
  Top Layer w0.254: v1(40.87,58.18) 34.89,58.18 34.87,58.19 ; D19.2 44.16,76.98 v1(40.87,76.98)
  Inner1 w0.254: v1(40.87,76.98) v1(40.87,58.18)
$1N1283: length 34.6
  Top Layer w0.254: D20.2 49.88,76.98 v1(46.89,76.98) ; 34.87,57.54 34.99,57.42 v1(46.89,57.42)
  Inner1 w0.254: v1(46.89,76.98) v1(46.89,57.42)
$1N1288: length 45.3
  Top Layer w0.254: v1(52.53,76.98) 55.85,76.98 D21.2 ; U2.7 29.16,58.18 v1(30.72,58.18)
  Inner1 w0.254: v1(52.53,76.98) v1(52.53,58.93)
  Inner2 w0.254: v1(30.72,58.18) 37.49,58.18 37.49,58.55 37.86,58.93 v1(52.53,58.93)
$1N1295: length 26.8
  Top Layer w0.254: D25.2 49.59,43.81 v1(49.9,43.51) ; v1(50.29,30.23) 50.29,31.85 U3.15
  Inner1 w0.254: v1(50.29,30.23) 50.29,32.39 49.9,32.79 v1(49.9,43.51)
$1N1300: length 18.3
  Top Layer w0.254: D26.2 38.5,37.86 v1(50.65,37.86) ; U3.14 50.84,33.16 v1(50.65,33.35)
  Inner1 w0.254: v1(50.65,33.35) v1(50.65,37.86)
$1N1305: length 18.6
  Top Layer w0.254: U3.13 51.54,31.9 51.54,29.59 38.23,29.59 v1(38.23,30.1)
  Inner1 w0.254: v1(38.23,30.1) 38.23,32.23 D27.2
$1N1318: length 29
  Top Layer w0.254: D29.2 38.54,21.31 v1(41.25,21.31) ; v1(41.25,34.1) 52.12,34.1 52.79,33.43 U3.11
  Inner1 w0.254: v1(41.25,34.1) v1(41.25,21.31)
$1N1345: length 18.2
  Top Layer w0.254: v1(39.5,28.83) 39.88,29.21 52.14,29.21 U3.12
  Inner1 w0.254: D28.2 39.5,27.78 v1(39.5,28.83)
$1N1348: length 30.9
  Top Layer w0.254: U3.10 53.29,31.79 53.29,28.84 42.75,28.84 v1(42.75,28.46) ; D30.2 38.47,16.05 v1(42.75,16.05)
  Inner1 w0.254: v1(42.75,28.46) v1(42.75,16.05)
$1N1353: length 39.3
  Top Layer w0.254: U3.9 54.95,31.09 v1(55.54,31.09) ; D31.2 38.53,10.78 v1(55.54,10.78)
  Inner1 w0.254: v1(55.54,31.09) v1(55.54,10.78)
$1N1358: length 36.1
  Top Layer w0.254: v1(53.34,23.88) 53.34,26.12 U3.7 ; v1(53.29,5.14) 38.45,5.14 D32.2
  Inner1 w0.254: v1(53.29,5.14) 53.34,5.19 v1(53.34,23.88)
